# EAGLE schematic SparkFun_RTK_EVK (EAGLE 9.6.2)

## Sheet 1 of 2
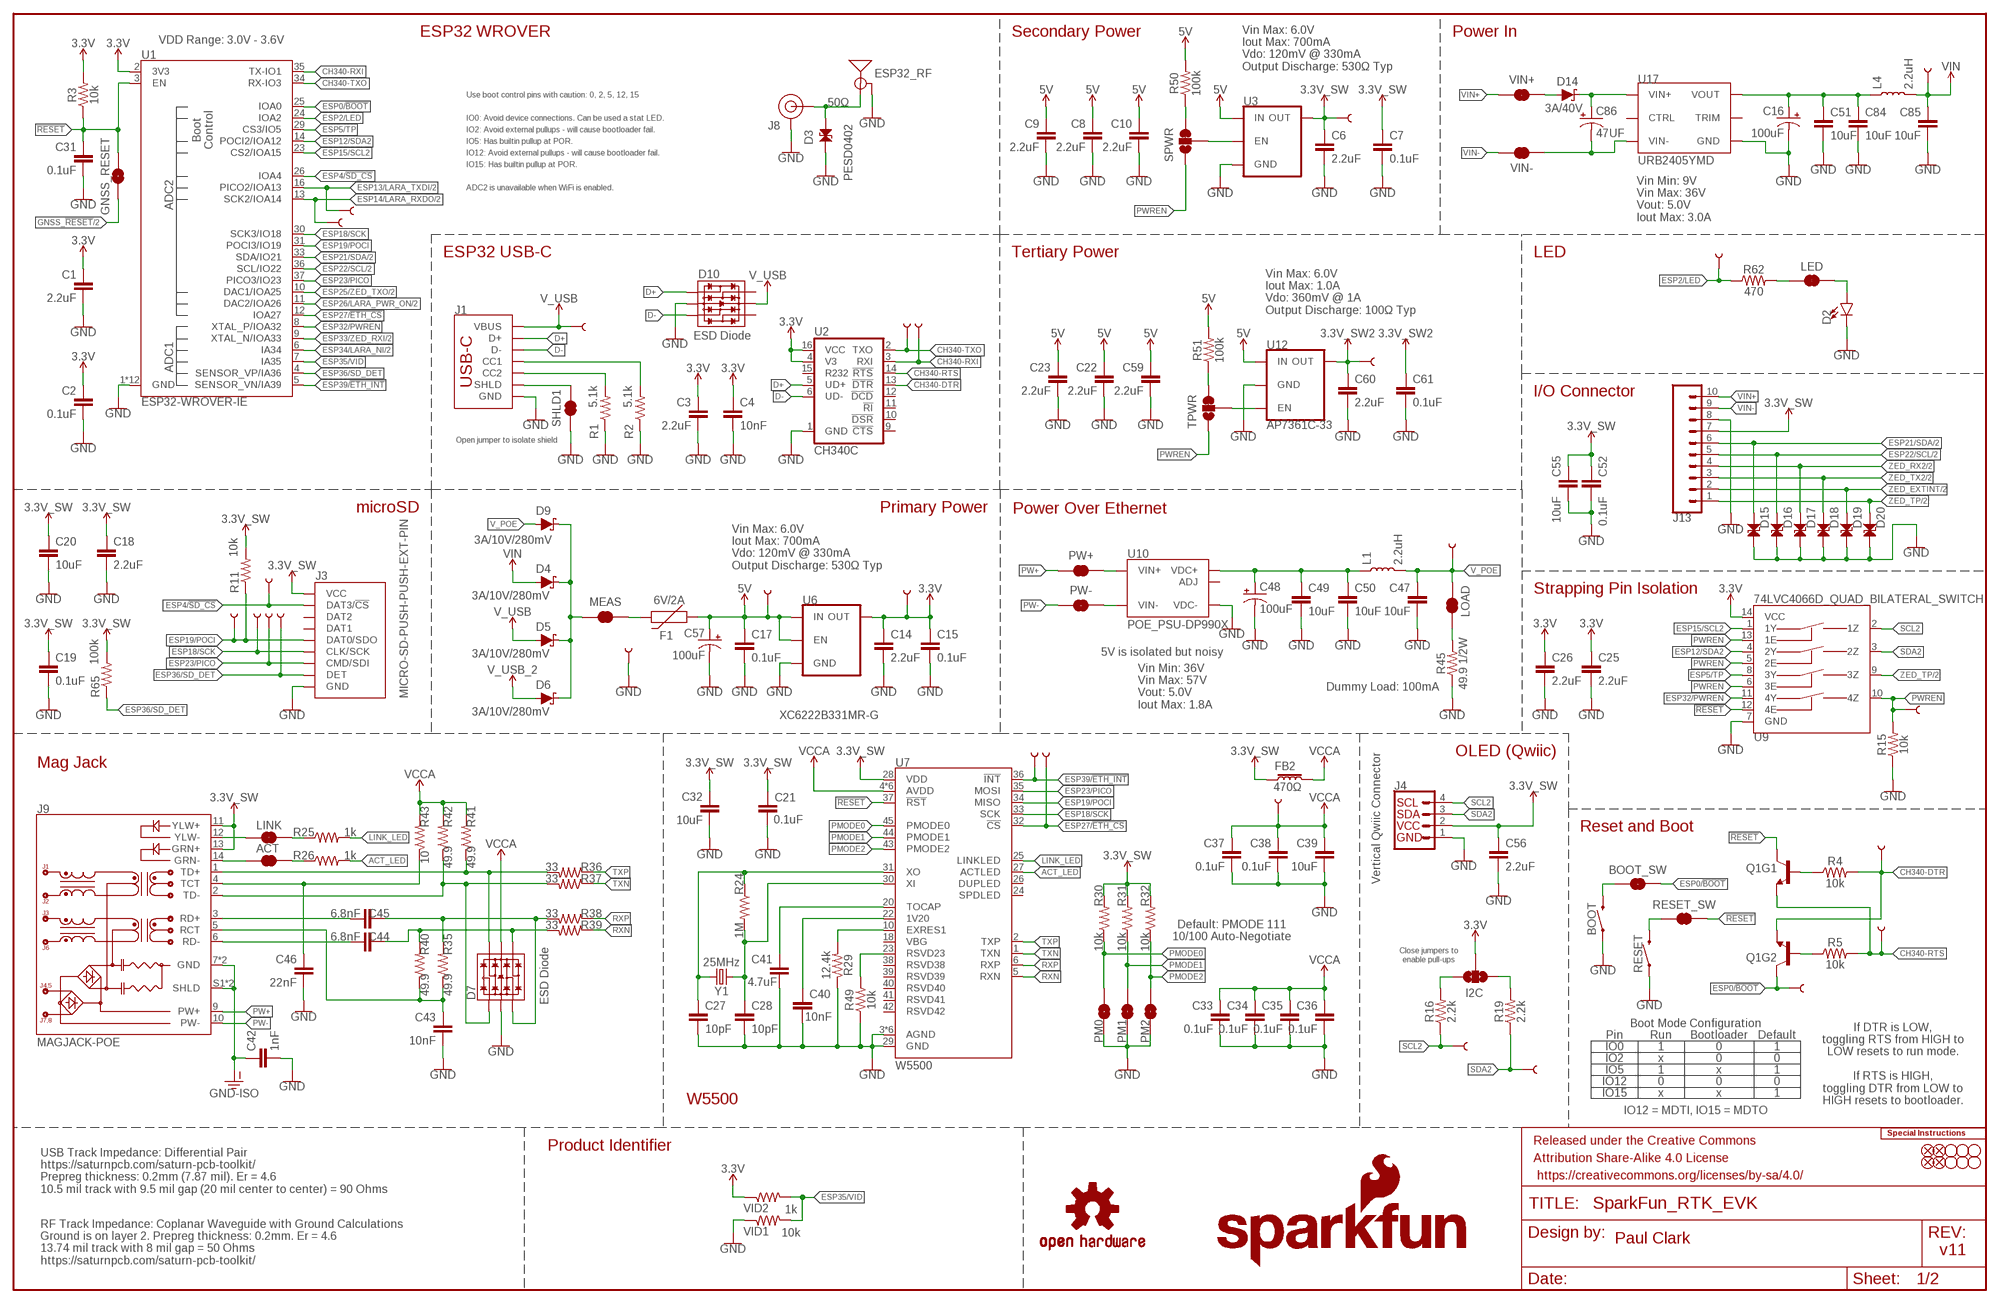
[diagram p0: schematic, sheet 1]

### Parts
3V3  TEST-POINTPOGO_PTH  [1X01_NO_SILK]
3V3_SW  TEST-POINTPOGO_PTH  [1X01_NO_SILK]
3V3_SW2  TEST-POINTPOGO_PTH  [1X01_NO_SILK]
5V  TEST-POINTPOGO_PTH  [1X01_NO_SILK]
ACT  JUMPER-SMT_2_NC_TRACE_SILK  [SMT-JUMPER_2_NC_TRACE_SILK]
BOOT  MOMENTARY-SWITCH-SPST-PTH-RIGHT-ANGLE-8-020  [TACTILE_SWITCH_PTH_RA_8-020]
BOOT_SW  JUMPER-SMT_2_NC_TRACE_SILK  [SMT-JUMPER_2_NC_TRACE_SILK]
C1  2.2uF  2.2UF-0603-10V-20%  [0603]
C2  0.1uF  0.1UF-0603-25V-5%  [0603]
C3  2.2uF  2.2UF-0603-10V-20%  [0603]
C4  10nF  10NF-0603-50V-10%  [0603]
C6  2.2uF  2.2UF-0603-10V-20%  [0603]
C7  0.1uF  0.1UF-0603-25V-5%  [0603]
C8  2.2uF  2.2UF-0603-10V-20%  [0603]
C9  2.2uF  2.2UF-0603-10V-20%  [0603]
C10  2.2uF  2.2UF-0603-10V-20%  [0603]
C14  2.2uF  2.2UF-0603-10V-20%  [0603]
C15  0.1uF  0.1UF-0603-25V-5%  [0603]
C16  100uF  100UF-POLAR-25V-20%(ELEC)  [PANASONIC_D]
C17  0.1uF  0.1UF-0603-25V-5%  [0603]
C18  2.2uF  2.2UF-0603-10V-20%  [0603]
C19  0.1uF  0.1UF-0603-25V-5%  [0603]
C20  10uF  10UF-0603-6.3V-20%  [0603]
C21  0.1uF  0.1UF-0603-25V-5%  [0603]
C22  2.2uF  2.2UF-0603-10V-20%  [0603]
C23  2.2uF  2.2UF-0603-10V-20%  [0603]
C25  2.2uF  2.2UF-0603-10V-20%  [0603]
C26  2.2uF  2.2UF-0603-10V-20%  [0603]
C27  10pF  10PF-0603-50V-5%  [0603]
C28  10pF  10PF-0603-50V-5%  [0603]
C31  0.1uF  0.1UF-0603-25V-5%  [0603]
C32  10uF  10UF-0603-6.3V-20%  [0603]
C33  0.1uF  0.1UF-0603-25V-5%  [0603]
C34  0.1uF  0.1UF-0603-25V-5%  [0603]
C35  0.1uF  0.1UF-0603-25V-5%  [0603]
C36  0.1uF  0.1UF-0603-25V-5%  [0603]
C37  0.1uF  0.1UF-0603-25V-5%  [0603]
C38  0.1uF  0.1UF-0603-25V-5%  [0603]
C39  10uF  10UF-0603-6.3V-20%  [0603]
C40  10nF  10NF-0603-50V-10%  [0603]
C41  4.7uF  4.7UF-0603-6.3V-(10%)  [0603]
C42  1nF  1.0NF/1000PF-1206-2KV-10%  [1206]
C43  10nF  10NF-0603-50V-10%  [0603]
C44  6.8nF  6.8NF/6800PF-0603-50V-5%  [0603]
C45  6.8nF  6.8NF/6800PF-0603-50V-5%  [0603]
C46  22nF  22NF/22,000PF-0603-50V-10%  [0603]
C47  10uF  10UF-0805-25V-10%  [0805]
C48  100uF  100UF-POLAR-25V-20%(ELEC)  [PANASONIC_D]
C49  10uF  10UF-0805-25V-10%  [0805]
C50  10uF  10UF-0805-25V-10%  [0805]
C51  10uF  10UF-0805-25V-10%  [0805]
C52  0.1uF  0.1UF-0603-25V-5%  [0603]
C55  10uF  10UF-0603-6.3V-20%  [0603]
C56  2.2uF  2.2UF-0603-10V-20%  [0603]
C57  100uF  100UF-POLAR-25V-20%(ELEC)  [PANASONIC_D]
C59  2.2uF  2.2UF-0603-10V-20%  [0603]
C60  2.2uF  2.2UF-0603-10V-20%  [0603]
C61  0.1uF  0.1UF-0603-25V-5%  [0603]
C84  10uF  10UF-0805-25V-10%  [0805]
C85  10uF  10UF-0805-25V-10%  [0805]
C86  47UF  47UF-POLAR-PANASONIC_D-50V-20%  [PANASONIC_D]
D2  LED-RIGHT-ANGLE-PTH-GREEN  [CBI-RIGHT-ANGLE-PTH]
D3  PESD0402  PESD0402-0402  [0402]
D4  3A/10V/280mV  DIODE-SCHOTTKY-BAT60A  [SOD-323]
D5  3A/10V/280mV  DIODE-SCHOTTKY-BAT60A  [SOD-323]
D6  3A/10V/280mV  DIODE-SCHOTTKY-BAT60A  [SOD-323]
D7  ESD Diode  TVS_DIODE_ARRAY_DT1042-04SO-7  [SOT-23-6]
D9  3A/10V/280mV  DIODE-SCHOTTKY-BAT60A  [SOD-323]
D10  ESD Diode  TVS_DIODE_ARRAY_DT1042-04SO-7  [SOT-23-6]
D14  3A/40V  DIODE-SCHOTTKY-B340A  [SMA-DIODE]
D15  PESD0402-0402  [0402]
D16  PESD0402-0402  [0402]
D17  PESD0402-0402  [0402]
D18  PESD0402-0402  [0402]
D19  PESD0402-0402  [0402]
D20  PESD0402-0402  [0402]
DET  TEST-POINTPOGO_PTH  [1X01_NO_SILK]
DTR  TEST-POINTPOGO_PTH  [1X01_NO_SILK]
ESP32_RF  ANTENNA-SMA-GROUNDEDEDGE_RPSMA  [RP-SMA-EDGE]
ETH_CS  TEST-POINTPOGO_PTH  [1X01_NO_SILK]
ETH_INT  TEST-POINTPOGO_PTH  [1X01_NO_SILK]
F1  6V/2A  PPTC_6V2A  [1210]
FB2  470Ω  FERRITE_BEAD-0603-470Ω-100MHZ-1A-200MILIΩ  [0603]
FD1  FIDUCIAL1X2  [FIDUCIAL-1X2]
FD2  FIDUCIAL1X2  [FIDUCIAL-1X2]
FD3  FIDUCIAL1X2  [FIDUCIAL-1X2]
FD4  FIDUCIAL1X2  [FIDUCIAL-1X2]
FRAME1  FRAME-LEDGER  [CREATIVE_COMMONS]
GND  TEST-POINTPOGO_PTH  [1X01_NO_SILK]
GNSS_RESET  JUMPER-COMBO_2_NO  [COMBO-JUMPER_2_NO]
H1  STAND-OFFTIGHT  [STAND-OFF-TIGHT]
H2  STAND-OFFTIGHT  [STAND-OFF-TIGHT]
H3  STAND-OFFTIGHT  [STAND-OFF-TIGHT]
H4  STAND-OFFTIGHT  [STAND-OFF-TIGHT]
H5  STAND-OFFTIGHT  [STAND-OFF-TIGHT]
H6  STAND-OFFTIGHT  [STAND-OFF-TIGHT]
I2C  JUMPER-SMT_3_NO_SILK  [SMT-JUMPER_3_NO_SILK]
J1  USB_C_4-LAYER_PADS  [USB-C-16P_4LAYER-PADS]
J3  MICRO-SD-PUSH-PUSH-EXT-PIN  [MICROSD-EXTERNALPIN]
J4  Vertical Qwiic Connector  QWIIC_CONNECTOR  [JST04_1MM_VERT]
J8  U.FL2PIN-REDUCED-FOOTPRINT  [U.FL_REDUCED_FOOTPRINT]
J9  MAGJACK-POE  [MAGJACK-SYM_LED]
J13  CONN_10_3.5MM_RA_HEADER  [1X10_SCREW_TERMINAL_3.5MM]
L1  2.2uH  INDUCTOR-0805_WIDE-2.2UH  [0805-WIDE]
L4  2.2uH  INDUCTOR-0805_WIDE-2.2UH  [0805-WIDE]
LED  JUMPER-SMT_2_NC_TRACE_SILK  [SMT-JUMPER_2_NC_TRACE_SILK]
LINK  JUMPER-SMT_2_NC_TRACE_SILK  [SMT-JUMPER_2_NC_TRACE_SILK]
LOAD  JUMPER-SMT_2_NC_TRACE_SILK  [SMT-JUMPER_2_NC_TRACE_SILK]
LOGO1  SPECIAL_INSTRUCTIONS-ORDERING  [ORDERING_INSTRUCTIONS]
LOGO4  OSHW-LOGOS  [OSHW-LOGO-S]
LOGO5  SFE_LOGO_NAME.2_INCH  [SFE_LOGO_NAME_.2]
LOGO6  SFE_LOGO_FLAME.2_INCH  [SFE_LOGO_FLAME_.2]
MEAS  JUMPER-COMBO_2_NC_TRACE  [COMBO-JUMPER_2_NC_TRACE]
PICO  TEST-POINTPOGO_PTH  [1X01_NO_SILK]
PM0  JUMPER-SMT_2_NO_SILK  [SMT-JUMPER_2_NO_SILK]
PM1  JUMPER-SMT_2_NO_SILK  [SMT-JUMPER_2_NO_SILK]
PM2  JUMPER-SMT_2_NO_SILK  [SMT-JUMPER_2_NO_SILK]
POCI  TEST-POINTPOGO_PTH  [1X01_NO_SILK]
PW+  JUMPER-COMBO_2_NC_TRACE  [COMBO-JUMPER_2_NC_TRACE]
PW-  JUMPER-COMBO_2_NC_TRACE  [COMBO-JUMPER_2_NC_TRACE]
PWREN  TEST-POINTPOGO_PTH  [1X01_NO_SILK]
Q1  TRANS_NPN_DUAL-MBT3904DW1T1  [SC70-6]
R1  5.1k  5.1KOHM5.1KOHM-0603-1/10W-1%  [0603]
R2  5.1k  5.1KOHM5.1KOHM-0603-1/10W-1%  [0603]
R3  10k  10KOHM-0603-1/10W-1%  [0603]
R4  10k  10KOHM-0603-1/10W-1%  [0603]
R5  10k  10KOHM-0603-1/10W-1%  [0603]
R11  10k  10KOHM-0603-1/10W-1%  [0603]
R15  10k  10KOHM-0603-1/10W-1%  [0603]
R16  2.2k  2.2KOHM-0603-1/10W-1%  [0603]
R19  2.2k  2.2KOHM-0603-1/10W-1%  [0603]
R24  1M  1MOHM-0603-1/4W-5%  [0603]
R25  1k  1KOHM-0603-1/10W-1%  [0603]
R26  1k  1KOHM-0603-1/10W-1%  [0603]
R29  12.4k  12.4KOHM-0603-1/10W-1%  [0603]
R30  10k  10KOHM-0603-1/10W-1%  [0603]
R31  10k  10KOHM-0603-1/10W-1%  [0603]
R32  10k  10KOHM-0603-1/10W-1%  [0603]
R35  49.9  49.9OHM-0603-1/10W-1%  [0603]
R36  33  33OHM-0603-1/10W-1%  [0603]
R37  33  33OHM-0603-1/10W-1%  [0603]
R38  33  33OHM-0603-1/10W-1%  [0603]
R39  33  33OHM-0603-1/10W-1%  [0603]
R40  49.9  49.9OHM-0603-1/10W-1%  [0603]
R41  49.9  49.9OHM-0603-1/10W-1%  [0603]
R42  49.9  49.9OHM-0603-1/10W-1%  [0603]
R43  10  10OHM-0603-1/10W-1%  [0603]
R45  49.9 1/2W  49.9OHM-1206-1/2W-1%  [1206]
R49  10k  10KOHM-0603-1/10W-1%  [0603]
R50  100k  100KOHM-0603-1/10W-1%  [0603]
R51  100k  100KOHM-0603-1/10W-1%  [0603]
R62  470  470OHM-0603-1/10W-1%  [0603]
R65  100k  100KOHM-0603-1/10W-1%  [0603]
RESET  MOMENTARY-SWITCH-SPST-PTH-RIGHT-ANGLE-8-020  [TACTILE_SWITCH_PTH_RA_8-020]
RESET_SW  JUMPER-SMT_2_NC_TRACE_SILK  [SMT-JUMPER_2_NC_TRACE_SILK]
RTS  TEST-POINTPOGO_PTH  [1X01_NO_SILK]
RX  TEST-POINTPOGO_PTH  [1X01_NO_SILK]
RXD  TEST-POINTPOGO_PTH  [1X01_NO_SILK]
SCK  TEST-POINTPOGO_PTH  [1X01_NO_SILK]
SCL2  TEST-POINTPOGO_PTH  [1X01_NO_SILK]
SD_CS  TEST-POINTPOGO_PTH  [1X01_NO_SILK]
SDA2  TEST-POINTPOGO_PTH  [1X01_NO_SILK]
SHLD1  JUMPER-SMT_2_NC_TRACE_SILK  [SMT-JUMPER_2_NC_TRACE_SILK]
SPWR  JUMPER-SMT_3_1-NC_TRACE_SILK  [SMT-JUMPER_3_1-NC_TRACE_SILK]
TP_BOOT  TEST-POINTPOGO_PTH  [1X01_NO_SILK]
TP_LED  TEST-POINTPOGO_PTH  [1X01_NO_SILK]
TPWR  JUMPER-SMT_3_1-NC_TRACE_SILK  [SMT-JUMPER_3_1-NC_TRACE_SILK]
TX  TEST-POINTPOGO_PTH  [1X01_NO_SILK]
TXD  TEST-POINTPOGO_PTH  [1X01_NO_SILK]
U1  ESP32-WROVER-IE  ESP32-WROVER-E/IE_IE-N16R8  [ESP32-WROVER-E/IE]
U2  CH340C  [SO016]
U3  XC6222B331MR-G  [SOT23-5]
U6  XC6222B331MR-G  [SOT23-5]
U7  W5500  [LQFP-48]
U9  74LVC4066D_QUAD_BILATERAL_SWITCH  [SO14]
U10  POE_PSU-DP990X  [DP990X]
U12  AP7361C-33  AP7361C-33FGEUDFN-8  [UDFN-8]
U17  URB2405YMD  URB_YMD-15WR3__URB2405YMD-15WR3  [URB_YMD-15WR3]
VCCA  TEST-POINTPOGO_PTH  [1X01_NO_SILK]
VID1  10k  10KOHM-0603-1/10W-1%  [0603]
VID2  1k  1KOHM-0603-1/10W-1%  [0603]
VIN  TEST-POINTPOGO_PTH  [1X01_NO_SILK]
VIN+  JUMPER-COMBO_2_NC_TRACE  [COMBO-JUMPER_2_NC_TRACE]
VIN-  JUMPER-COMBO_2_NC_TRACE  [COMBO-JUMPER_2_NC_TRACE]
VPOE  TEST-POINTPOGO_PTH  [1X01_NO_SILK]
VUSB  TEST-POINTPOGO_PTH  [1X01_NO_SILK]
Y1  25MHz  CRYSTAL-25MHZ-SMD-2.0X1.6MM  [CRYSTAL-SMD-2.0X1.6MM]

### Nets
3.3V: 3V3.1 C1.1 C2.1 C3.1 C4.1 C14.1 C15.1 C25.1 C26.1 I2C.2 R3.2 U1.2(3V3) U2.4(V3) U2.16(VCC) U6.5(OUT) U9.14(VCC) VID2.1
3.3V_SW: 3V3_SW.1 C6.1 C7.1 C18.1 C19.1 C20.1 C21.1 C32.1 C52.1 C55.1 C56.1 FB2.1 J3.4(VCC) J4.2 J9.11(YLW+) J9.13(GRN+) J13.7 R11.2 R30.2 R31.2 R32.2 R65.2 U3.5(OUT) U7.28(VDD) ; also sheet 2
3.3V_SW2: 3V3_SW2.1 C60.1 C61.1 U12.1(OUT) ; also sheet 2
5V: 5V.1 C8.1 C9.1 C10.1 C17.1 C22.1 C23.1 C57.+ C59.1 F1.1 R50.2 R51.2 U3.1(IN) U6.1(IN) U6.3(EN) U12.8(IN) ; also sheet 2
5V_RAW: C48.+ C49.1 C50.1 L1.1 U10.1(VDC+) U10.2(VDC+)
5V_RAW1: C16.+ C51.1 C84.1 L4.1 U17.4(VOUT)
!RESET!: C31.1 GNSS_RESET.2 GNSS_RESET.4 Q1.3(C) R3.1 RESET_SW.1 U1.3(EN) U7.37(!RST!) U9.12(4E)
ACT: ACT.1 J9.14(GRN-)
ACT_LED: R26.2 U7.27(ACTLED)
CH340-DTR: DTR.1 Q1.1(E) R4.2 U2.13(!DTR)
CH340-RTS: Q1.4(E) R5.2 RTS.1 U2.14(!RTS)
CH340-RXI: TX.1 U1.35(TX-IO1) U2.3(RXI)
CH340-TXO: RX.1 U1.34(RX-IO3) U2.2(TXO)
D+: D10.1(IO1) J1.A6(D+) J1.B6(D+) U2.5(UD+)
D-: D10.3(IO2) J1.A7(D-) J1.B7(D-) U2.6(UD-)
ESP0/!BOOT!: BOOT_SW.1 Q1.6(C) TP_BOOT.1 U1.25(IOA0)
ESP2/LED: R62.1 TP_LED.1 U1.24(IOA2)
ESP4/!SD_CS!: J3.2(DAT3/!CS!) SD_CS.1 U1.26(IOA4)
ESP5/TP: U1.29(CS3/IO5) U9.8(3Y)
ESP12/SDA2: U1.14(POCI2/IOA12) U9.4(2Y)
ESP13/LARA_TXDI: TXD.1 U1.16(PICO2/IOA13) ; also sheet 2
ESP14/LARA_RXDO: RXD.1 U1.13(SCK2/IOA14) ; also sheet 2
ESP15/SCL2: U1.23(CS2/IOA15) U9.1(1Y)
ESP18/SCK: J3.5(CLK/SCK) SCK.1 U1.30(SCK3/IO18) U7.33(SCK)
ESP19/POCI: J3.7(DAT0/SDO) POCI.1 R11.1 U1.31(POCI3/IO19) U7.34(MISO)
ESP21/SDA: D15.1 J13.6 U1.33(SDA/IO21) ; also sheet 2
ESP22/SCL: D16.1 J13.5 U1.36(SCL/IO22) ; also sheet 2
ESP23/PICO: J3.3(CMD/SDI) PICO.1 U1.37(PICO3/IO23) U7.35(MOSI)
ESP25/ZED_TXO: U1.10(DAC1/IOA25) ; also sheet 2
ESP26/LARA_PWR_ON: U1.11(DAC2/IOA26) ; also sheet 2
ESP27/!ETH_CS!: ETH_CS.1 U1.12(IOA27) U7.32(!CS!)
ESP32/PWREN: U1.8(XTAL_P/IOA32) U9.11(4Y)
ESP33/ZED_RXI: U1.9(XTAL_N/IOA33) ; also sheet 2
ESP34/LARA_NI: U1.6(IA34) ; also sheet 2
ESP35/VID: U1.7(IA35) VID1.2 VID2.2
ESP36/SD_DET: DET.1 J3.9(DET) R65.1 U1.4(SENSOR_VP/IA36)
ESP39/!ETH_INT!: ETH_INT.1 U1.5(SENSOR_VN/IA39) U7.36(!INT!)
GND: BOOT.1 C1.2 C2.2 C3.2 C4.2 C6.2 C7.2 C8.2 C9.2 C10.2 C14.2 C15.2 C16.- C17.2 C18.2 C19.2 C20.2 C21.2 C22.2 C23.2 C25.2 C26.2 C27.2 C28.2 C31.2 C32.2 C33.2 C34.2 C35.2 C36.2 C37.2 C38.2 C39.2 C40.2 C41.2 C42.2 C43.2 C46.2 C47.2 C48.- C49.2 C50.2 C51.2 C52.2 C55.2 C56.2 C57.- C59.2 C60.2 C61.2 C84.2 C85.2 D2.C D3.2 D7.2(VSS) D10.2(VSS) D15.2 D16.2 D17.2 D18.2 D19.2 D20.2 ESP32_RF.GND@0(GND) ESP32_RF.GND@1(GND) ESP32_RF.GND@2(GND) ESP32_RF.GND@3(GND) GND.1 J1.GND J1.GND2(GND) J3.6(GND) J3.10(GND) J3.11(GND) J3.12(GND) J3.13(GND) J4.1 J8.1(GND) J8.2(GND) J13.8 PM0.1 PM1.1 PM2.1 R1.1 R2.1 R15.1 R29.1 R45.1 R49.1 RESET.1 SHLD1.1 U1.1(GND) U1.15(GND) U1.38(GND) U1.GND U1.GNDT1(GND) U1.GNDT2(GND) U1.GNDT3(GND) U1.GNDT4(GND) U1.GNDT5(GND) U1.GNDT6(GND) U1.GNDT7(GND) U1.GNDT8(GND) U2.1(GND) U3.2(GND) U6.2(GND) U7.3(AGND) U7.9(AGND) U7.14(AGND) U7.16(AGND) U7.19(AGND) U7.29(GND) U7.48(AGND) U9.7(GND) U10.3(VDC-) U12.4(GND) U12.EP(GND) U17.6(GND) VID1.1 ; also sheet 2
GND-ISO: C42.1 J9.7(GND) J9.8(GND) J9.S1(SHLD) J9.S2(SHLD)
GNSS_!RESET!: GNSS_RESET.1 GNSS_RESET.3 ; also sheet 2
LINK: J9.12(YLW-) LINK.1
LINK_LED: R25.2 U7.25(LINKLED)
MEAS: D4.C D5.C D6.C D9.C MEAS.2 MEAS.4
N$1: J1.B5(CC2) R1.2
N$2: J1.A5(CC1) R2.2
N$4: Q1.2(B) R5.1
N$5: Q1.5(B) R4.1
N$7: LED.2 R62.2
N$10: F1.2 MEAS.1 MEAS.3
N$12: ACT.2 R26.1
N$13: D3.1 ESP32_RF.SIG(SIGNAL) J8.FEED(SIGNAL)
N$14: I2C.3 R16.2
N$15: I2C.1 R19.2
N$19: C27.1 R24.1 U7.31(XO) Y1.1
N$20: C28.1 R24.2 U7.30(XI) Y1.3
N$21: LINK.2 R25.1
N$22: R50.1 SPWR.3
N$23: R29.2 U7.10(EXRES1)
N$24: C40.1 U7.22(1V20)
N$25: C41.1 U7.20(TOCAP)
N$26: SPWR.2 U3.3(EN)
N$27: LOAD.1 R45.2
N$28: RESET.2 RESET_SW.2
N$29: BOOT.2 BOOT_SW.2
N$30: R49.2 U7.23(RSVD23)
N$31: R51.1 TPWR.3
N$39: TPWR.2 U12.5(EN)
N$45: D2.A LED.1
PMODE0: PM0.2 R30.1 U7.45(PMODE0)
PMODE1: PM1.2 R31.1 U7.44(PMODE1)
PMODE2: PM2.2 R32.1 U7.43(PMODE2)
PW1+: PW+.1 PW+.3 U10.5(VIN+) U10.6(VIN+)
PW1-: PW-.1 PW-.3 U10.7(VIN-) U10.8(VIN-)
PW+: J9.9(PW+) PW+.2 PW+.4
PW-: J9.10(PW-) PW-.2 PW-.4
PWREN: PWREN.1 R15.2 SPWR.1 TPWR.1 U9.5(2E) U9.6(3E) U9.10(4Z) U9.13(1E)
RCT: C43.1 J9.5(RCT) R35.1 R40.1
RD+: C45.2 J9.3(RD+)
RD-: C44.2 J9.6(RD-)
RXN: R39.1 U7.5(RXN)
RXN1: C44.1 D7.4(IO3) R39.2 R40.2
RXP: R38.1 U7.6(RXP)
RXP1: C45.1 D7.3(IO2) R35.2 R38.2
SCL2: J4.4 R16.1 SCL2.1 U9.2(1Z)
SDA2: J4.3 R19.1 SDA2.1 U9.3(2Z)
SHIELD: J1.SHLD1(SHLD) J1.SHLD2(SHLD) J1.SHLD3(SHLD) J1.SHLD4(SHLD) SHLD1.2
TCT: C46.1 J9.4(TCT) R43.1
TD+: D7.6(IO4) J9.1(TD+) R36.2 R41.1
TD-: D7.1(IO1) J9.2(TD-) R37.2 R42.1
TXN: R37.1 U7.1(TXN)
TXP: R36.1 U7.2(TXP)
V_POE: C47.1 D9.A L1.2 LOAD.2 VPOE.1
V_USB: D5.A D10.5(VCC) J1.VBUS1(VBUS) J1.VBUS2(VBUS) VUSB.1
V_USB_2: D6.A ; also sheet 2
VCCA: C33.1 C34.1 C35.1 C36.1 C37.1 C38.1 C39.1 D7.5(VCC) FB2.2 R41.2 R42.2 R43.2 U7.4(AVDD) U7.8(AVDD) U7.11(AVDD) U7.15(AVDD) U7.17(AVDD) U7.21(AVDD) VCCA.1
VIN: C85.1 D4.A L4.2 VIN.1
VIN1+: D14.A VIN+.1 VIN+.3
VIN1-: C86.- U17.2(VIN-) VIN-.2 VIN-.4
VIN2+: C86.+ D14.C U17.3(VIN+)
VIN+: J13.10 VIN+.2 VIN+.4
VIN-: J13.9 VIN-.1 VIN-.3
ZED_EXTINT: D19.1 J13.2 ; also sheet 2
ZED_RX2: D17.1 J13.4 ; also sheet 2
ZED_TP: D20.1 J13.1 U9.9(3Z) ; also sheet 2
ZED_TX2: D18.1 J13.3 ; also sheet 2
Unconnected: D10.4(IO3) D10.6(IO4) J3.1(DAT2) J3.8(DAT1) U2.9(!CTS) U2.10(!DSR) U2.11(!RI) U2.12(!DCD) U2.15(R232) U7.18(VBG) U7.24(SPDLED) U7.26(DUPLED) U7.38(RSVD38) U7.39(RSVD39) U7.40(RSVD40) U7.41(RSVD41) U7.42(RSVD42) U10.4(ADJ) U17.1(CTRL) U17.5(TRIM)

### Notes on the sheet
- Secondary Power | Power In
- VDD Range: 3.0V - 3.6V | ESP32 WROVER
- Vin Max: 6.0V
  Iout Max: 700mA
  Vdo: 120mV @ 330mA
  Output Discharge: 530Ω Typ
- Use boot control pins with caution: 0, 2, 5, 12, 15
- 50Ω
- IO0: Avoid device connections. Can be used a stat LED.
- IO2: Avoid external pullups - will cause bootloader fail.
- IO5: Has builtin pullup at POR.
- IO12: Avoid external pullups - will cause bootloader fail.
- IO15: Has builtin pullup at POR.
- ADC2 is unavailable when WiFi is enabled.
- Vin Min: 9V
  Vin Max: 36V
  Vout: 5.0V
  Iout Max: 3.0A
- ESP32 USB-C | Tertiary Power | LED
- Vin Max: 6.0V
  Iout Max: 1.0A
  Vdo: 360mV @ 1A
  Output Discharge: 100Ω Typ
- I/O Connector
- Open jumper to isolate shield
- microSD | Primary Power | Power Over Ethernet
- Vin Max: 6.0V
  Iout Max: 700mA
  Vdo: 120mV @ 330mA
  Output Discharge: 530Ω Typ
- Strapping Pin Isolation
- 5V is isolated but noisy
- Dummy Load: 100mA
- Vin Min: 36V
  Vin Max: 57V
  Vout: 5.0V
  Iout Max: 1.8A
- OLED (Qwiic)
- Mag Jack
- Reset and Boot
- Default: PMODE 111
  10/100 Auto-Negotiate
- Close jumpers to
  enable pull-ups
- Boot Mode Configuration
- If DTR is LOW,
  toggling RTS from HIGH to
  LOW resets to run mode.
  
  If RTS is HIGH,
  toggling DTR from LOW to
  HIGH resets to bootloader.
- Pin | Run | Bootloader | Default
- IO0 | 1 | 0 | 1
- IO2 | x | 0 | 0
- IO5 | 1 | x | 1
- IO12 | 0 | 0 | 0
- IO15 | x | x | 1
- W5500
- IO12 = MDTI, IO15 = MDTO
- Product Identifier
- USB Track Impedance: Differential Pair
  https://saturnpcb.com/saturn-pcb-toolkit/
  Prepreg thickness: 0.2mm (7.87 mil). Er = 4.6
  10.5 mil track with 9.5 mil gap (20 mil center to center) = 90 Ohms
- Paul Clark
- v11
- RF Track Impedance: Coplanar Waveguide with Ground Calculations
  Ground is on layer 2. Prepreg thickness: 0.2mm. Er = 4.6
  13.74 mil track with 8 mil gap = 50 Ohms
  https://saturnpcb.com/saturn-pcb-toolkit/

## Sheet 2 of 2
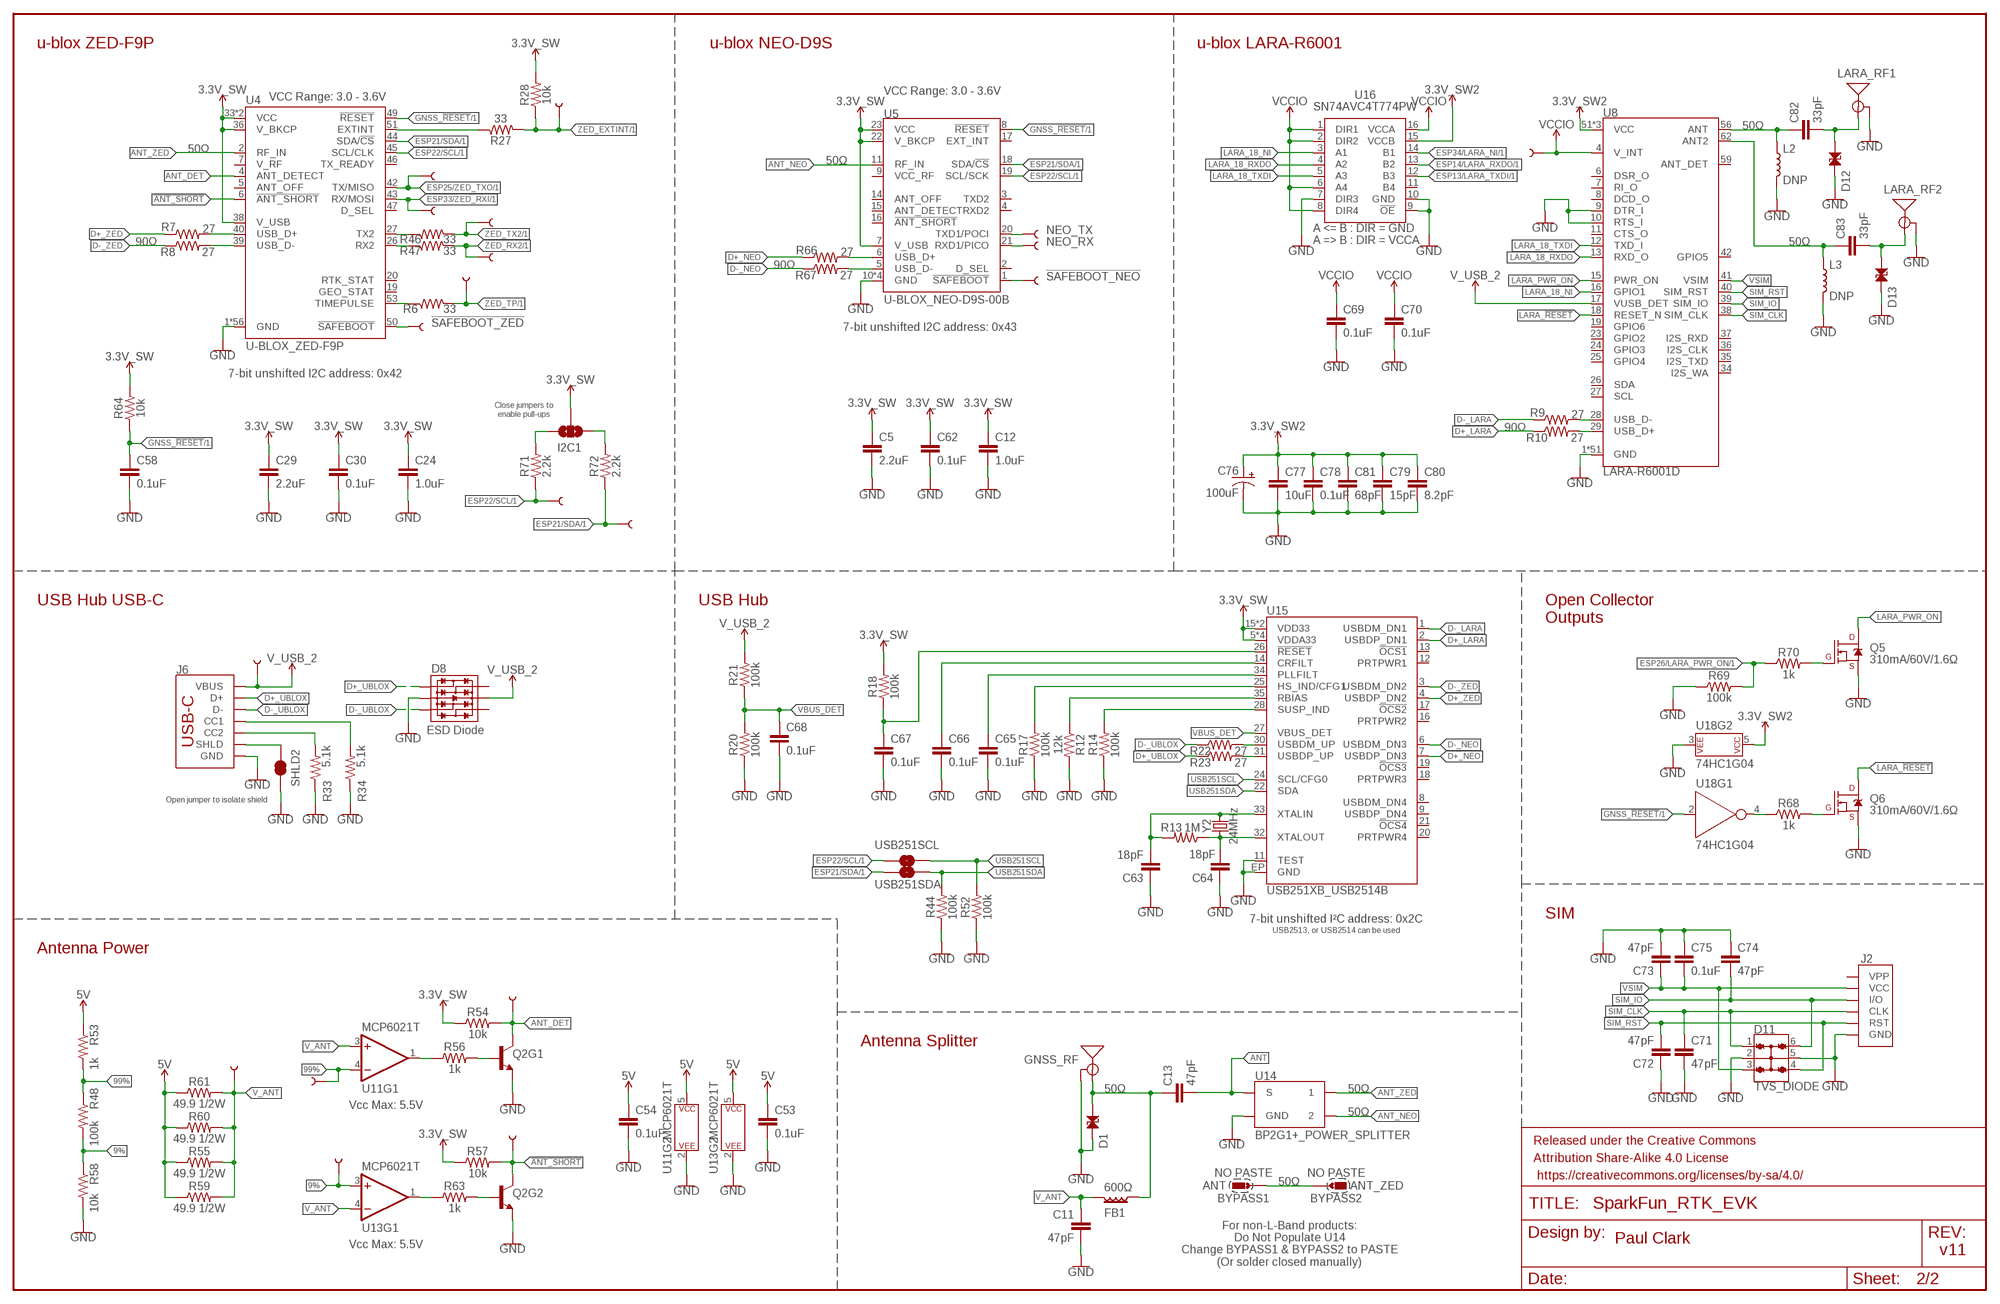
[diagram p1: schematic, sheet 2]

### Parts
9%  TEST-POINTPOGO_PTH  [1X01_NO_SILK]
99%  TEST-POINTPOGO_PTH  [1X01_NO_SILK]
!SAFEBOOT_NEO!  TEST-POINTPOGO_PTH  [1X01_NO_SILK]
!SAFEBOOT_ZED!  TEST-POINTPOGO_PTH  [1X01_NO_SILK]
ANT_DET  TEST-POINTPOGO_PTH  [1X01_NO_SILK]
ANT_SHT  TEST-POINTPOGO_PTH  [1X01_NO_SILK]
BYPASS1  NO PASTE  JUMPER-SMT_2_SOIC-PAD_NO-PASTE  [SMT-JUMPER_2_SOIC-PAD_NO-PASTE]
BYPASS2  NO PASTE  JUMPER-SMT_2_SOIC-PAD_NO-PASTE  [SMT-JUMPER_2_SOIC-PAD_NO-PASTE]
C5  2.2uF  2.2UF-0603-10V-20%  [0603]
C11  47pF  47PF-0603-50V-5%  [0603]
C12  1.0uF  1.0UF-0603-16V-10%  [0603]
C13  47pF  47PF-0603-50V-5%  [0603]
C24  1.0uF  1.0UF-0603-16V-10%  [0603]
C29  2.2uF  2.2UF-0603-10V-20%  [0603]
C30  0.1uF  0.1UF-0603-25V-5%  [0603]
C53  0.1uF  0.1UF-0603-25V-5%  [0603]
C54  0.1uF  0.1UF-0603-25V-5%  [0603]
C58  0.1uF  0.1UF-0603-25V-5%  [0603]
C62  0.1uF  0.1UF-0603-25V-5%  [0603]
C63  18pF  18PF-0603-50V-5%  [0603]
C64  18pF  18PF-0603-50V-5%  [0603]
C65  0.1uF  0.1UF-0603-25V-5%  [0603]
C66  0.1uF  0.1UF-0603-25V-5%  [0603]
C67  0.1uF  0.1UF-0603-25V-5%  [0603]
C68  0.1uF  0.1UF-0603-25V-5%  [0603]
C69  0.1uF  0.1UF-0603-25V-5%  [0603]
C70  0.1uF  0.1UF-0603-25V-5%  [0603]
C71  47pF  47PF-0603-50V-5%  [0603]
C72  47pF  47PF-0603-50V-5%  [0603]
C73  47pF  47PF-0603-50V-5%  [0603]
C74  47pF  47PF-0603-50V-5%  [0603]
C75  0.1uF  0.1UF-0603-25V-5%  [0603]
C76  100uF  100UF-POLAR-25V-20%(ELEC)  [PANASONIC_D]
C77  10uF  10UF-0805-25V-10%  [0805]
C78  0.1uF  0.1UF-0603-25V-5%  [0603]
C79  15pF  15PF-0603-50V-5%  [0603]
C80  8.2pF  8.2PF-0603-50V-10%  [0603]
C81  68pF  68PF-0603-50V-5%  [0603]
C82  33pF  33PF-0603-50V-5%  [0603]
C83  33pF  33PF-0603-50V-5%  [0603]
D1  PESD0402-0402  [0402]
D8  ESD Diode  TVS_DIODE_ARRAY_DT1042-04SO-7  [SOT-23-6]
D11  TVS_DIODE  TVS_DIODE_ARRAY_4_ESDA6V1BC6  [SOT23-6L]
D12  PESD0402-0402  [0402]
D13  PESD0402-0402  [0402]
FB1  600Ω  FERRITE_BEAD-0805-600Ω-100MHZ  [0805]
FRAME2  FRAME-LEDGERNO_FOOTPRINT  [DUMMY]
GNSS_RF  ANTENNA-SMA-GROUNDEDEDGE_SMA  [SMA-EDGE]
I2C1  JUMPER-SMT_3_NO_SILK  [SMT-JUMPER_3_NO_SILK]
J2  SIMHOLDER-PUSHPUSH  [NANO_SIM_PP]
J6  USB_C_4-LAYER_PADS  [USB-C-16P_4LAYER-PADS]
L2  DNP  DNP-0603_NO-CREAM  [0603_NO-CREAM]
L3  DNP  DNP-0603_NO-CREAM  [0603_NO-CREAM]
LARA_RF1  ANTENNA-SMA-GROUNDEDEDGE_SMA  [SMA-EDGE]
LARA_RF2  ANTENNA-SMA-GROUNDEDEDGE_SMA  [SMA-EDGE]
NEO_RX  TEST-POINTPOGO_PTH  [1X01_NO_SILK]
NEO_TX  TEST-POINTPOGO_PTH  [1X01_NO_SILK]
Q2  TRANS_NPN_DUAL-MBT3904DW1T1  [SC70-6]
Q5  310mA/60V/1.6Ω  MOSFET-NCH-2N7002PW  [SOT323]
Q6  310mA/60V/1.6Ω  MOSFET-NCH-2N7002PW  [SOT323]
R6  33  33OHM-0603-1/10W-1%  [0603]
R7  27  27OHM-0603-1/10W-1%  [0603]
R8  27  27OHM-0603-1/10W-1%  [0603]
R9  27  27OHM-0603-1/10W-1%  [0603]
R10  27  27OHM-0603-1/10W-1%  [0603]
R12  12k  12KOHM-0603-1/10W-1%  [0603]
R13  1M  1MOHM-0603-1/4W-5%  [0603]
R14  100k  100KOHM-0603-1/10W-1%  [0603]
R17  100k  100KOHM-0603-1/10W-1%  [0603]
R18  100k  100KOHM-0603-1/10W-1%  [0603]
R20  100k  100KOHM-0603-1/10W-1%  [0603]
R21  100k  100KOHM-0603-1/10W-1%  [0603]
R22  27  27OHM-0603-1/10W-1%  [0603]
R23  27  27OHM-0603-1/10W-1%  [0603]
R27  33  33OHM-0603-1/10W-1%  [0603]
R28  10k  10KOHM-0603-1/10W-1%  [0603]
R33  5.1k  5.1KOHM5.1KOHM-0603-1/10W-1%  [0603]
R34  5.1k  5.1KOHM5.1KOHM-0603-1/10W-1%  [0603]
R44  100k  100KOHM-0603-1/10W-1%  [0603]
R46  33  33OHM-0603-1/10W-1%  [0603]
R47  33  33OHM-0603-1/10W-1%  [0603]
R48  100k  100KOHM-0603-1/10W-1%  [0603]
R52  100k  100KOHM-0603-1/10W-1%  [0603]
R53  1k  1KOHM-0603-1/10W-1%  [0603]
R54  10k  10KOHM-0603-1/10W-1%  [0603]
R55  49.9 1/2W  49.9OHM-1206-1/2W-1%  [1206]
R56  1k  1KOHM-0603-1/10W-1%  [0603]
R57  10k  10KOHM-0603-1/10W-1%  [0603]
R58  10k  10KOHM-0603-1/10W-1%  [0603]
R59  49.9 1/2W  49.9OHM-1206-1/2W-1%  [1206]
R60  49.9 1/2W  49.9OHM-1206-1/2W-1%  [1206]
R61  49.9 1/2W  49.9OHM-1206-1/2W-1%  [1206]
R63  1k  1KOHM-0603-1/10W-1%  [0603]
R64  10k  10KOHM-0603-1/10W-1%  [0603]
R66  27  27OHM-0603-1/10W-1%  [0603]
R67  27  27OHM-0603-1/10W-1%  [0603]
R68  1k  1KOHM-0603-1/10W-1%  [0603]
R69  100k  100KOHM-0603-1/10W-1%  [0603]
R70  1k  1KOHM-0603-1/10W-1%  [0603]
R71  2.2k  2.2KOHM-0603-1/10W-1%  [0603]
R72  2.2k  2.2KOHM-0603-1/10W-1%  [0603]
RX2  TEST-POINTPOGO_PTH  [1X01_NO_SILK]
SCL  TEST-POINTPOGO_PTH  [1X01_NO_SILK]
SDA  TEST-POINTPOGO_PTH  [1X01_NO_SILK]
SHLD2  JUMPER-SMT_2_NC_TRACE_SILK  [SMT-JUMPER_2_NC_TRACE_SILK]
TP  TEST-POINTPOGO_PTH  [1X01_NO_SILK]
TX2  TEST-POINTPOGO_PTH  [1X01_NO_SILK]
U4  U-BLOX_ZED-F9P  [ZED-F9P]
U5  U-BLOX_NEO-D9S-00B  [NEO-M9N/M8T/M8U/D9S]
U8  LARA-R6001D  LARA-R6_R6001D_GLOBAL_DATA-ONLY  [LARA-LGA]
U11  MCP6021T  MCP6021T-E/OT  [SOT23-5]
U13  MCP6021T  MCP6021T-E/OT  [SOT23-5]
U14  BP2G1+_POWER_SPLITTER  [XX21]
U15  USB251XB_USB2514B  [QFN-36]
U16  SN74AVC4T774PW  [SOP65P640X120-16N]
U18  74HC1G04  [SOT353]
USB251SCL  JUMPER-SMT_2_NO_SILK  [SMT-JUMPER_2_NO_SILK]
USB251SDA  JUMPER-SMT_2_NO_SILK  [SMT-JUMPER_2_NO_SILK]
VANT  TEST-POINTPOGO_PTH  [1X01_NO_SILK]
VCCIO  TEST-POINTPOGO_PTH  [1X01_NO_SILK]
VUSB2  TEST-POINTPOGO_PTH  [1X01_NO_SILK]
Y2  24MHz  CRYSTAL-24MHZ-SMD-2.0X1.6MM  [CRYSTAL-SMD-2.0X1.6MM]
ZED_EXTINT  TEST-POINTPOGO_PTH  [1X01_NO_SILK]
ZED_RXI  TEST-POINTPOGO_PTH  [1X01_NO_SILK]
ZED_TXO  TEST-POINTPOGO_PTH  [1X01_NO_SILK]

### Nets
3.3V_SW: C5.1 C12.1 C24.1 C29.1 C30.1 C62.1 I2C1.2 R18.2 R28.2 R54.1 R57.1 R64.2 U4.33(VCC) U4.34(VCC) U4.36(V_BKCP) U4.38(V_USB) U5.7(V_USB) U5.22(V_BKCP) U5.23(VCC) U15.5(VDDA33) U15.10(VDDA33) U15.15(VDD33) U15.23(VDD33) U15.29(VDDA33) U15.36(VDDA33) ; also sheet 1
3.3V_SW2: C76.+ C77.1 C78.1 C79.1 C80.1 C81.1 U8.51(VCC) U8.52(VCC) U8.53(VCC) U16.15(VCCB) U18.5(P$V+) ; also sheet 1
5V: C53.1 C54.1 R53.1 R55.1 R59.1 R60.1 R61.1 U11.5(P$V+) U13.5(P$V+) ; also sheet 1
9%: 9%.1 R48.2 R58.1 U13.3(+IN)
99%: 99%.1 R48.1 R53.2 U11.4(-IN)
!ANT_SHORT!: ANT_SHT.1 Q2.6(C) R57.2 U4.6(!ANT_SHORT!)
!SAFEBOOT_NEO!: !SAFEBOOT_NEO!.1 U5.1(!SAFEBOOT!)
!SAFEBOOT_ZED!: !SAFEBOOT_ZED!.1 U4.50(!SAFEBOOT!)
ANT: C13.2 U14.2(S)
ANT_DET: ANT_DET.1 Q2.3(C) R54.2 U4.4(ANT_DETECT)
ANT_NEO: U5.11(RF_IN) U14.5
ANT_ZED: U4.2(RF_IN) U14.8
BYPASS: BYPASS1.1 BYPASS2.1
D+_LARA: R10.1 U15.2(USBDP_DN1)
D+_NEO: R66.1 U15.7(USBDP_DN3)
D+_UBLOX: D8.1(IO1) J6.A6(D+) J6.B6(D+) R23.1
D+_ZED: R7.1 U15.4(USBDP_DN2)
D-_LARA: R9.1 U15.1(USBDM_DN1)
D-_NEO: R67.1 U15.6(USBDM_DN3)
D-_UBLOX: D8.3(IO2) J6.A7(D-) J6.B7(D-) R22.1
D-_ZED: R8.1 U15.3(USBDM_DN2)
ESP13/LARA_TXDI: U16.12(B3) ; also sheet 1
ESP14/LARA_RXDO: U16.13(B2) ; also sheet 1
ESP21/SDA: R72.1 SDA.1 U4.44(SDA/!CS!) U5.18(SDA/!CS!) USB251SDA.1 ; also sheet 1
ESP22/SCL: R71.1 SCL.1 U4.45(SCL/CLK) U5.19(SCL/SCK) USB251SCL.1 ; also sheet 1
ESP25/ZED_TXO: U4.42(TX/MISO) ZED_TXO.1 ; also sheet 1
ESP26/LARA_PWR_ON: R69.2 R70.1 ; also sheet 1
ESP33/ZED_RXI: U4.43(RX/MOSI) ZED_RXI.1 ; also sheet 1
ESP34/LARA_NI: U16.14(B1) ; also sheet 1
GND: C5.2 C11.2 C12.2 C24.2 C29.2 C30.2 C53.2 C54.2 C58.2 C62.2 C63.1 C64.1 C65.2 C66.2 C67.2 C68.2 C69.2 C70.2 C71.2 C72.1 C73.2 C74.1 C75.1 C76.- C77.2 C78.2 C79.2 C80.2 C81.2 D1.2 D8.2(VSS) D11.2 D11.5 D12.2 D13.2 GNSS_RF.GND@0(GND) GNSS_RF.GND@1(GND) GNSS_RF.GND@2(GND) GNSS_RF.GND@3(GND) J2.C5(GND) J6.GND J6.GND2(GND) L2.2 L3.2 LARA_RF1.GND@0(GND) LARA_RF1.GND@1(GND) LARA_RF1.GND@2(GND) LARA_RF1.GND@3(GND) LARA_RF2.GND@0(GND) LARA_RF2.GND@1(GND) LARA_RF2.GND@2(GND) LARA_RF2.GND@3(GND) Q2.1(E) Q2.4(E) Q5.2(S) Q6.2(S) R12.2 R14.1 R17.1 R20.1 R33.1 R34.1 R44.1 R52.1 R58.2 R69.1 SHLD2.1 U4.1(GND) U4.3(GND) U4.12(GND) U4.14(GND) U4.32(GND) U4.37(GND) U4.41(GND) U4.48(GND) U4.55(GND) U4.56(GND) U4.57(GND) U4.58(GND) U4.59(GND) U4.60(GND) U4.61(GND) U4.62(GND) U4.63(GND) U4.64(GND) U4.65(GND) U4.66(GND) U4.67(GND) U4.68(GND) U4.69(GND) U4.70(GND) U4.71(GND) U4.72(GND) U4.73(GND) U4.74(GND) U4.75(GND) U4.76(GND) U4.77(GND) U4.78(GND) U4.79(GND) U4.80(GND) U4.81(GND) U4.82(GND) U4.83(GND) U4.84(GND) U4.85(GND) U4.86(GND) U4.87(GND) U4.88(GND) U4.89(GND) U4.90(GND) U4.91(GND) U4.92(GND) U4.93(GND) U4.94(GND) U4.95(GND) U4.96(GND) U4.97(GND) U4.98(GND) U4.99(GND) U4.100(GND) U4.101(GND) U4.102(GND) U5.10(GND) U5.12(GND) U5.13(GND) U5.24(GND) U8.1(GND) U8.3(GND) U8.5(GND) U8.9(DTR_I) U8.10(RTS_I) U8.14(GND) U8.20(GND) U8.21(GND) U8.22(GND) U8.30(GND) U8.32(GND) U8.43(GND) U8.50(GND) U8.54(GND) U8.55(GND) U8.57(GND) U8.58(GND) U8.60(GND) U8.61(GND) U8.63(GND) U8.64(GND) U8.65(GND) U8.66(GND) U8.67(GND) U8.68(GND) U8.69(GND) U8.70(GND) U8.71(GND) U8.72(GND) U8.73(GND) U8.74(GND) U8.75(GND) U8.76(GND) U8.77(GND) U8.78(GND) U8.79(GND) U8.80(GND) U8.81(GND) U8.82(GND) U8.83(GND) U8.84(GND) U8.85(GND) U8.86(GND) U8.87(GND) U8.88(GND) U8.89(GND) U8.90(GND) U8.91(GND) U8.92(GND) U8.93(GND) U8.94(GND) U8.95(GND) U8.96(GND) U11.2(P$V-) U13.2(P$V-) U14.1(GND) U14.3(GND) U14.4(GND) U14.6(GND) U14.7(GND) U15.11(TEST) U15.EP(GND) U16.7(DIR3) U16.9(!OE) U16.10(GND) U18.3(P$V-) ; also sheet 1
GNSS_!RESET!: C58.1 R64.1 U4.49(!RESET!) U5.8(!RESET!) U18.2(A) ; also sheet 1
LARA_18_NI: U8.16(GPIO1) U16.3(A1)
LARA_18_RXDO: U8.13(RXD_O) U16.4(A2)
LARA_18_TXDI: U8.12(TXD_I) U16.5(A3)
LARA_!RESET!: Q6.3(D) U8.18(RESET_N)
LARA_PWR_ON: Q5.3(D) U8.15(PWR_ON)
N$3: R7.2 U4.40(USB_D+)
N$6: R8.2 U4.39(USB_D-)
N$8: J6.SHLD1(SHLD) J6.SHLD2(SHLD) J6.SHLD3(SHLD) J6.SHLD4(SHLD) SHLD2.2
N$9: R27.1 U4.51(EXTINT)
N$11: R46.1 U4.27(TX2)
N$16: R68.1 U18.4(Y)
N$17: R66.2 U5.6(USB_D+)
N$18: R67.2 U5.5(USB_D-)
N$32: R47.1 U4.26(RX2)
N$33: J6.B5(CC2) R33.2
N$34: J6.A5(CC1) R34.2
N$35: R56.1 U11.1(OUT)
N$36: R6.1 U4.53(TIMEPULSE)
N$38: Q2.5(B) R56.2
N$40: Q2.2(B) R63.2
N$41: R63.1 U13.1(OUT)
N$42: Q6.1(G) R68.2
N$43: I2C1.3 R71.2
N$44: I2C1.1 R72.2
N$46: R9.2 U8.28(USB_D-)
N$47: R10.2 U8.29(USB_D+)
N$48: C63.2 R13.2 U15.33(XTALIN) Y2.3
N$49: C64.2 R13.1 U15.32(XTALOUT) Y2.1
N$50: R12.1 U15.35(RBIAS)
N$51: R14.2 U15.28(SUSP_IND)
N$52: R17.2 U15.25(HS_IND/CFG1)
N$53: C65.1 U15.34(PLLFILT)
N$54: C66.1 U15.14(CRFILT)
N$55: R22.2 U15.30(USBDM_UP)
N$56: R23.2 U15.31(USBDP_UP)
N$61: C82.2 D12.1 LARA_RF1.SIG(SIGNAL)
N$62: C82.1 L2.1 U8.56(ANT)
N$63: C83.2 D13.1 LARA_RF2.SIG(SIGNAL)
N$64: C83.1 L3.1 U8.62(ANT2)
N$65: Q5.1(G) R70.2
NEO_RXI: NEO_RX.1 U5.21(RXD1/PICO)
NEO_TXO: NEO_TX.1 U5.20(TXD1/POCI)
RF: C13.1 D1.1 FB1.2 GNSS_RF.SIG(SIGNAL)
SIM_CLK: C71.1 D11.1 J2.C3(CLK) U8.38(SIM_CLK)
SIM_IO: C74.2 D11.6 J2.C7(I/O) U8.39(SIM_IO)
SIM_RST: C72.2 D11.4 J2.C2(RST) U8.40(SIM_RST)
USB251SCL: R52.2 U15.24(SCL/CFG0) USB251SCL.2
USB251SDA: R44.2 U15.22(SDA) USB251SDA.2
USB_!RESET: C67.1 R18.1 U15.26(!RESET)
V_ANT: C11.1 FB1.1 R55.2 R59.2 R60.2 R61.2 U11.3(+IN) U13.4(-IN) VANT.1
V_USB_2: D8.5(VCC) J6.VBUS1(VBUS) J6.VBUS2(VBUS) R21.2 U8.17(VUSB_DET) VUSB2.1 ; also sheet 1
VBUS_DET: C68.1 R20.2 R21.1 U15.27(VBUS_DET)
VCCIO: C69.1 C70.1 U8.4(V_INT) U16.1(DIR1) U16.2(DIR2) U16.6(A4) U16.8(DIR4) U16.16(VCCA) VCCIO.1
VSIM: C73.1 C75.2 D11.3 J2.C1(VCC) U8.41(VSIM)
ZED_EXTINT: R27.2 R28.1 ZED_EXTINT.1 ; also sheet 1
ZED_RX2: R47.2 RX2.1 ; also sheet 1
ZED_TP: R6.2 TP.1 ; also sheet 1
ZED_TX2: R46.2 TX2.1 ; also sheet 1
Unconnected: D8.4(IO3) D8.6(IO4) J2.C6(VPP) U4.5(ANT_OFF) U4.7(V_RF) U4.19(GEO_STAT) U4.20(RTK_STAT) U4.46(TX_READY) U4.47(D_SEL) U5.2(D_SEL) U5.3(TXD2) U5.4(RXD2) U5.9(VCC_RF) U5.14(ANT_OFF) U5.15(ANT_DETECT) U5.16(!ANT_SHORT!) U5.17(EXT_INT) U8.6(DSR_O) U8.7(RI_O) U8.8(DCD_O) U8.11(CTS_O) U8.19(GPIO6) U8.23(GPIO2) U8.24(GPIO3) U8.25(GPIO4) U8.26(SDA) U8.27(SCL) U8.34(I2S_WA) U8.35(I2S_TXD) U8.36(I2S_CLK) U8.37(I2S_RXD) U8.42(GPIO5) U8.59(ANT_DET) U15.8(USBDM_DN4) U15.9(USBDP_DN4) U15.12(PRTPWR1) U15.13(!OCS1) U15.16(PRTPWR2) U15.17(!OCS2) U15.18(PRTPWR3) U15.19(!OCS3) U15.20(PRTPWR4) U15.21(!OCS4) U16.11(B4)

### Notes on the sheet
- u-blox ZED-F9P | u-blox NEO-D9S | u-blox LARA-R6001
- VCC Range: 3.0 - 3.6V
- VCC Range: 3.0 - 3.6V
- 50Ω
- 50Ω
- 50Ω
- 90Ω | 50Ω
- 90Ω
- 7-bit unshifted I2C address: 0x43
- 7-bit unshifted I2C address: 0x42
- Close jumpers to
  enable pull-ups
- 90Ω
- USB Hub USB-C | USB Hub
- Open Collector
  Outputs
- Open jumper to isolate shield
- SIM
- 7-bit unshifted I²C address: 0x2C
- USB2513, or USB2514 can be used
- Antenna Power
- Antenna Splitter
- 50Ω | 50Ω
- Vcc Max: 5.5V
- 50Ω
- ANT | 50Ω | ANT_ZED
- For non-L-Band products:
  Do Not Populate U14
  Change BYPASS1 & BYPASS2 to PASTE
  (Or solder closed manually)
- Paul Clark
- Vcc Max: 5.5V
- v11

## Library data of the parts
3V3 3V3_SW 3V3_SW2 5V 9% 99% !SAFEBOOT_NEO! !SAFEBOOT_ZED! ANT_DET ANT_SHT DET DTR ETH_CS ETH_INT GND NEO_RX NEO_TX PICO POCI PWREN RTS RX RX2 RXD SCK SCL SCL2 SD_CS SDA SDA2 TP TP_BOOT TP_LED TX TX2 TXD VANT VCCA VCCIO VIN VPOE VUSB VUSB2 ZED_EXTINT ZED_RXI ZED_TXO = SparkFun-Connectors:TEST-POINT: SparkFun Test Points Bare copper test points for troubleshooting or In-Circuit-Testing. These are used by our Production team for verifying production board runs using pogo-pins on test beds. SparkFun Products: SparkFun LSM9DS1 Breakout <https://www.sparkfun.com/products/13284> SparkFun PSOC <https://www.sparkfun.com/products/13714> SparkFun Load Cell Amplifier <https://www.sparkfun.com/products/13879>
ACT BOOT_SW LED LINK LOAD RESET_SW SHLD1 SHLD2 = SparkFun-Jumpers:JUMPER-SMT_2_NC_TRACE: Normally closed trace jumper This jumper has a trace between two pads so it's normally closed (NC). Use a razor knife to open the connection. For best results follow the IPC guidelines for cutting traces: Cutout at least 0.063 mm (0.005 in). Remove all loose material to clean up the cut area. Seal the cut with an approved epoxy. Reapply solder to reclose the connection.
BOOT RESET = SparkFun-Switches:MOMENTARY-SWITCH-SPST: Momentary Switch (Pushbutton) - SPST Normally-open (NO) SPST momentary switches (buttons, pushbuttons). Variants PTH-12MM - 12mm square, through-hole Momentary Pushbutton Switch - 12mm Square <https://www.sparkfun.com/products/9190> (COM-09190) PTH-6.0MM, PTH-6.0MM-KIT - 6.0mm square, through-hole Mini Pushbutton Switch <https://www.sparkfun.com/products/97> (COM-00097) KIT package intended for soldering kit's - only one side of pads' copper is exposed. PTH-RIGHT-ANGLE-KIT - Right-angle, through-hole Right Angle Tactile Button <https://www.sparkfun.com/products/10791> - Used on SparkFun BigTime Watch Kit <https://www.sparkfun.com/products/11734> SMD-12MM - 12mm square, surface-mount Tactile Button - SMD (12mm) <https://www.sparkfun.com/products/12993> (COM-12993) Used on SparkFun PicoBoard <https://www.sparkfun.com/products/11888> SMD-4.5MM - 4.5mm Square Trackball Switch Used on SparkFun Blackberry Trackballer Breakout <https://www.sparkfun.com/products/13169> SMD-4.6MMX2.8MM - 4.60mm x 2.80mm, surface mount Used on SparkFun Pro Micro - RP2040 <https://www.sparkfun.com/products/17717> SMD-5.2MM, SMD-5.2-REDUNDANT - 5.2mm square, surface-mount Mini Pushbutton Switch - SMD <https://www.sparkfun.com/products/8720> (COM-08720) Used on Arduino Pro Mini <https://www.sparkfun.com/products/11114> REDUNDANT package connects both switch circuits together SMD-6.0X3.5MM - 6.0 x 3.5mm, surface mount Momentary Reset Switch SMD <https://www.sparkfun.com/products/8229> (COM-08229) SMD-6.2MM-TALL - 6.2mm square, surface mount Tactile Button - SMD (6mm) <https://www.sparkfun.com/products/12992> Used on SparkFun Digital Sandbox <https://www.sparkfun.com/products/12651> SMD-RIGHT-ANGLE - Right-angle, surface mount Used on SparkFun Block for Intel® Edison - Arduino <https://www.sparkfun.com/products/13036>; PROD_ID: SWCH-13896
BYPASS1 BYPASS2 = SparkFun-Jumpers:JUMPER-SMT_2_SOIC-PAD_NO-PASTE
C1 C3 C5 C6 C8-C10 C14 C18 C22 C23 C25 C26 C29 C56 C59 C60 = SparkFun-Capacitors:2.2UF: 2.2µF ceramic capacitors A capacitor is a passive two-terminal electrical component used to store electrical energy temporarily in an electric field.; PROD_ID: CAP-07888
C2 C7 C15 C17 C19 C21 C30 C31 C33-C38 C52-C54 C58 C61 C62 C65-C70 C75 C78 = SparkFun-Capacitors:0.1UF: 0.1µF ceramic capacitors A capacitor is a passive two-terminal electrical component used to store electrical energy temporarily in an electric field.; PROD_ID: CAP-08604
C4 C40 C43 = SparkFun-Capacitors:10NF: 0.01uF/10nF/10,000pF ceramic capacitors A capacitor is a passive two-terminal electrical component used to store electrical energy temporarily in an electric field. CAP-09321; PROD_ID: CAP-00867
C11 C13 C71-C74 = SparkFun-Capacitors:47PF: 47pF ceramic capacitors A capacitor is a passive two-terminal electrical component used to store electrical energy temporarily in an electric field.; PROD_ID: CAP-08913
C12 C24 = SparkFun-Capacitors:1.0UF: 1µF ceramic capacitors A capacitor is a passive two-terminal electrical component used to store electrical energy temporarily in an electric field.; PROD_ID: CAP-00868
C16 C48 C57 C76 = SparkFun-Capacitors:100UF-POLAR: 100µF polarized capacitors A capacitor is a passive two-terminal electrical component used to store electrical energy temporarily in an electric field.; PROD_ID: CAP-12547
C20 C32 C39 C55 = SparkFun-Capacitors:10UF: 10.0µF ceramic capacitors A capacitor is a passive two-terminal electrical component used to store electrical energy temporarily in an electric field.; PROD_ID: CAP-11015
C27 C28 = SparkFun-Capacitors:10PF: 10pF ceramic capacitors A capacitor is a passive two-terminal electrical component used to store electrical energy temporarily in an electric field.; PROD_ID: CAP-11812
C41 = SparkFun-Capacitors:4.7UF: 4.7µF ceramic capacitors A capacitor is a passive two-terminal electrical component used to store electrical energy temporarily in an electric field.; PROD_ID: CAP-08280
C42 = SparkFun-Capacitors:1.0NF/1000PF: 1nF/1,000pF ceramic capacitors A capacitor is a passive two-terminal electrical component used to store electrical energy temporarily in an electric field.; PROD_ID: CAP-16238
C44 C45 = SparkFun-Capacitors:6.8NF/6800PF: 5.6nF/5600pF ceramic capacitors A capacitor is a passive two-terminal electrical component used to store electrical energy temporarily in an electric field.; PROD_ID: CAP-16239
C46 = SparkFun-Capacitors:22NF/22,000PF: 0.022uF/22nF/22,000pF ceramic capacitors A capacitor is a passive two-terminal electrical component used to store electrical energy temporarily in an electric field.; PROD_ID: CAP-07885
C47 C49-C51 C77 C84 C85 = SparkFun-Capacitors:10UF: 10.0µF ceramic capacitors A capacitor is a passive two-terminal electrical component used to store electrical energy temporarily in an electric field.; PROD_ID: CAP-14259
C63 C64 = SparkFun-Capacitors:18PF: 18pF ceramic capacitors A capacitor is a passive two-terminal electrical component used to store electrical energy temporarily in an electric field.; PROD_ID: CAP-08267
C79 = SparkFun-Capacitors:15PF: 15pF ceramic capacitors A capacitor is a passive two-terminal electrical component used to store electrical energy temporarily in an electric field.; PROD_ID: CAP-07881
C80 = SparkFun-Capacitors:8.2PF: 8.2pF ceramic capacitors A capacitor is a passive two-terminal electrical component used to store electrical energy temporarily in an electric field.; PROD_ID: CAP-16662
C81 = SparkFun-Capacitors:68PF: 68pF ceramic capacitors A capacitor is a passive two-terminal electrical component used to store electrical energy temporarily in an electric field.; PROD_ID: CAP-14092
C82 C83 = SparkFun-Capacitors:33PF: 33pF ceramic capacitors A capacitor is a passive two-terminal electrical component used to store electrical energy temporarily in an electric field.; PROD_ID: CAP-10142
C86 = SparkFun-Capacitors:47UF-POLAR: 47µF polarized capacitors A capacitor is a passive two-terminal electrical component used to store electrical energy temporarily in an electric field.; PROD_ID: CAP-10547
D1 D3 D12 D13 D15-D20 = SparkFun-DiscreteSemi:PESD0402: ESD protection diode PESD is used to protect a signal line from ESD.; DIGIKEY_PART: PESD0402-140CT-ND; MOUSE_PART: 650-PESD0402-140; PROD_ID: DIO-15359
D2 = SparkFun-LED:LED-RIGHT-ANGLE-PTH; PROD_ID: DIO-13847
D4-D6 D9 = SparkFun-DiscreteSemi:DIODE-SCHOTTKY: Schottky diode A Schottky diode is a semiconductor diode which has a low forward voltage drop and a very fast switching action.; PROD_ID: DIO-14072
D7 D8 D10 = SparkFun-DiscreteSemi:TVS_DIODE_ARRAY; PROD_ID: IC-13538
D11 = SparkFun-DiscreteSemi:TVS_DIODE_ARRAY_4; PROD_ID: DIO-14095
D14 = SparkFun-DiscreteSemi:DIODE-SCHOTTKY: Schottky diode A Schottky diode is a semiconductor diode which has a low forward voltage drop and a very fast switching action.; PROD_ID: DIO-09886; VALUE: 3A/40V/500mV
ESP32_RF = SparkFun-RF:ANTENNA-SMA-GROUNDED: SMA Antenna Connector w/ Ground Edge-mount and SMD SMA connectors for RF Antennas. **4-LAYER BOARD WARNING!!** When designing a 4-layer board using any of the SMD variants, you will need to manually add a cutout polygon on any internal power layers to make sure that you don't end up with exposed copper around the edge of the routed hole for these connectors. Exposed power copper could then short to the connector body - and that would be bad. Why hasn't anyone added the cutout polygons directly to the connector footprint? Well, your internal layers (usually 2 and 15) may be covered with GND polygons and you might well want the copper to go all the way to the edge, especially under the connector SIGNAL pin. So adding cutouts to the footprint might make matters worse, not better...; PROD_ID: CONN-00827
F1 = SparkFun-Fuses:PPTC: Resettable Fuse PPTC Resettable Fuse. Really a sort of resistor with a polymeric positive temperature coefficient whose resistance increases dramatically with an increase in temperature. When heated by the power passing through the resistance rises causing the current to be limited, protecting the circuit. This is achieved by the transition of the polymer from a crystalline to an amorphous state where the conductive carbon separates breaking the conductive pathways found in the cool crystalline structure. When a PPTC cools back down it resumes conducting letting the circuit turn back on. SparkFun Products: SparkFun RedBoard - Programmed with Arduino <https://www.sparkfun.com/products/12757> Pro Micro - 5V/16MHz <https://www.sparkfun.com/products/12640> Arduino Pro 328 - 5V/16MHz <https://www.sparkfun.com/products/10915> MP3 Trigger <https://www.sparkfun.com/products/13720>; PROD_ID: RES-14313
FB1 = SparkFun-Coils:FERRITE_BEAD: Ferrite Bead (blocks, cores, rings, chokes, etc.) Inductor with layers of ferrite used to suppress high frequencies. Often used to isolate high frequency noise. SparkFun Products: IOIO-OTG - V2.2 <https://www.sparkfun.com/products/13613> SparkFun SAMD21 Mini Breakout <https://www.sparkfun.com/products/13664> SparkFun 6 Degrees of Freedom Breakout - LSM6DS3 <https://www.sparkfun.com/products/13339> SparkFun SAMD21 Dev Breakout <https://www.sparkfun.com/products/13672> Lilypad MP3 <https://www.sparkfun.com/products/11013>; PROD_ID: NDUC-14988
FB2 = SparkFun-Coils:FERRITE_BEAD: Ferrite Bead (blocks, cores, rings, chokes, etc.) Inductor with layers of ferrite used to suppress high frequencies. Often used to isolate high frequency noise. SparkFun Products: IOIO-OTG - V2.2 <https://www.sparkfun.com/products/13613> SparkFun SAMD21 Mini Breakout <https://www.sparkfun.com/products/13664> SparkFun 6 Degrees of Freedom Breakout - LSM6DS3 <https://www.sparkfun.com/products/13339> SparkFun SAMD21 Dev Breakout <https://www.sparkfun.com/products/13672> Lilypad MP3 <https://www.sparkfun.com/products/11013>; PROD_ID: NDUC-12579
FD1-FD4 = SparkFun-Aesthetics:FIDUCIAL: Fiducial Alignment Points Point-of-reference for pick-and-place machines and other optical instruments.
FRAME1 FRAME2 = SparkFun-Aesthetics:FRAME-LEDGER: Schematic Frame - Ledger Standard 11x14 US Ledger frame
GNSS_RESET = SparkFun-Jumpers:JUMPER-COMBO_2_NO
GNSS_RF LARA_RF1 LARA_RF2 = SparkFun-RF:ANTENNA-SMA-GROUNDED: SMA Antenna Connector w/ Ground Edge-mount and SMD SMA connectors for RF Antennas. **4-LAYER BOARD WARNING!!** When designing a 4-layer board using any of the SMD variants, you will need to manually add a cutout polygon on any internal power layers to make sure that you don't end up with exposed copper around the edge of the routed hole for these connectors. Exposed power copper could then short to the connector body - and that would be bad. Why hasn't anyone added the cutout polygons directly to the connector footprint? Well, your internal layers (usually 2 and 15) may be covered with GND polygons and you might well want the copper to go all the way to the edge, especially under the connector SIGNAL pin. So adding cutouts to the footprint might make matters worse, not better...; PROD_ID: CONN-08289
H1-H6 = SparkFun-Hardware:STAND-OFF: Stand Off Drill holes for mechanically mounting via screws, standoffs, etc. Note: Use the keepout ring to avoid running the screw head into surrounding components. Variant Overviews STAND-OFF - Mechanical footprint for a #4 phillips button head screw. STAND-OFF-TIGHT - Mechanical footprint for a #4 phillips button head screw, Example SparkFun Products Screw - Phillips Head (1/4", 4-40, 10 pack) <https://www.sparkfun.com/products/10453> (PRT-10453) Screw - Phillips Head (1/2", 4-40, 10 pack) <https://www.sparkfun.com/products/10452> (PRT-10452) Screw - Phillips Head (3/4", 4-40, 10 pack) <https://www.sparkfun.com/products/10451> (PRT-10451) Screw - Phillips Head (1", 4-40, 10 pack) <https://www.sparkfun.com/products/10450> (PRT-10450)
I2C I2C1 = SparkFun-Jumpers:JUMPER-SMT_3_NO: Normally open jumper This jumper has three pads in close proximity to each other. Apply solder to close the connection(s).
J1 J6 = SparkFun-Connectors:USB_C: USB Type C 16Pin Connector Super Speed pins not available on the 16-pin purely SMD connector so this part is best for USB 2.0 implementations. D1 and D2 are tied together enabling D+/- no matter which way the cable is plugged into the connector. The two channel configuration pins (CC1/2) are exposed. These are normally connected to ground via 5.1k resistors but can be reconfigured for high current/high power applications. **4-LAYER BOARD WARNING!!** If designing 4-layer board, make sure to select the variant _4-LAYER-ISOLATED. The linked footprint (USB-C-16-4LAYER-ISOLATED) includes some very necessary cutout polygons in the inner layers (2 and 15). This prevents the PTH mounting shield legs on the USB connector from electrically connecting any other polygons on the inner layers (usually VCC and GND).; PROD_ID: CONN-14122
J2 = SparkFun-Connectors:SIMHOLDER: SIM Cellular Card Socket SMT 6 pin standard connection. SparkFun Products: SIM Socket <https://www.sparkfun.com/products/548> SparkFun Cellular Shield - MG2639 <https://www.sparkfun.com/products/13120> SparkFun SIM Card Socket Breakout <https://www.sparkfun.com/products/573>; PROD_ID: CONN-16272
J3 = SparkFun-Connectors:MICRO-SD: microSD Socket for Transflash Various sockets for µSD. tDoc lines correctly indicate media card edge positions when inserting (unlocked, locked, depressed). NOTE: CD1 and CD2 are connected internally, and the default detect state of the socket is detect pin to ground. SparkFun Products: WAV Trigger <https://www.sparkfun.com/products/13660> CAN-Bus Shield <https://www.sparkfun.com/products/13262> SparkFun Level Shifing microSD Breakout <https://www.sparkfun.com/products/13743>; PROD_ID: CONN-16110
J4 = SparkFun-Connectors:QWIIC_CONNECTOR: SparkFun I2C Standard Qwiic Connector An SMD 1mm pitch JST connector makes it easy and quick (get it? Qwiic?) to connect I2C devices to each other. The Qwiic system <http://www.sparkfun.com/qwiic> enables fast and solderless connection between popular platforms and various sensors and actuators. We carry 200mm <https://www.sparkfun.com/products/14204>, 100mm <https://www.sparkfun.com/products/14205>, 50mm <https://www.sparkfun.com/products/14206>, and breadboard friendly <https://www.sparkfun.com/products/14207> Qwiic cables. We also offer 10 pcs strips <https://www.sparkfun.com/products/14323> the SMD connectors.; PROD_ID: CONN-14483
J8 = SparkFun-Connectors:U.FL2PIN: SMD Antenna Connector - U.FL 2mm height, 3.0mm x 3.0mm receptacle size. SparkFun Products: SparkFun WiFi Shield - ESP8266 <https://www.sparkfun.com/products/13287> SparkFun ESP8266 Thing <https://www.sparkfun.com/products/13231> SparkFun MiniGen - Pro Mini Signal Generator Shield <https://www.sparkfun.com/products/11420>; PROD_ID: CONN-09193
J9 = SparkFun-Connectors:MAGJACK-POE: MAGJACK: RJ-45 with POE and LEDs This is a single port, RJ45 ethernet jacks with built in transformer (magnetics), PoE rectifier diodes, status LEDs, and shielding.; PROD_ID: CONN-16253
J13 = SparkFun-Connectors:CONN_10: Multi connection point. Often used as Generic Header-pin footprint for 0.1 inch spaced/style header connections On any of the 0.1 inch spaced packages, you can populate with these: Break Away Headers - Straight <https://www.sparkfun.com/products/116> (PRT-00116) Break Away Male Headers - Right Angle <https://www.sparkfun.com/products/553> (PRT-00553) Female Headers <https://www.sparkfun.com/products/115> (PRT-00115) Break Away Headers - Machine Pin <https://www.sparkfun.com/products/117> (PRT-00117) Break Away Female Headers - Swiss Machine Pin <https://www.sparkfun.com/products/743> (PRT-00743) Arduino Stackable Header - 10 Pin <https://www.sparkfun.com/products/11376> (PRT-11376) For SCREWTERMINALS and SPRING TERMINALS visit here: Screw Terimnals on SparkFun.com <https://www.sparkfun.com/search/results?term=Screw+Terminals> (5mm/3.5mm/2.54mm spacing) This device is also useful as a general connection point to wire up your design to another part of your project. Our various solder wires solder well into these plated through hole pads. Hook-Up Wire - Assortment (Stranded, 22 AWG) <https://www.sparkfun.com/products/11375> (PRT-11375) Hook-Up Wire - Assortment (Solid Core, 22 AWG) <https://www.sparkfun.com/products/11367> (PRT-11367) View the entire wire category on our website here <https://www.sparkfun.com/categories/141> Special notes: Molex polarized connector foot print use with SKU : PRT-08231 with associated crimp pins and housings. 1MM SMD Version SKU: PRT-10208 NOTES ON THE VARIANTS LOCK and LOCK_LONGPADS... This footprint was designed to help hold the alignment of a through-hole component (i.e. 6-pin header) while soldering it into place. You may notice that each hole has been shifted either up or down by 0.005 of an inch from it's more standard position (which is a perfectly straight line). This slight alteration caused the pins (the squares in the middle) to touch the edges of the holes. Because they are alternating, it causes a "brace" to hold the component in place. 0.005 has proven to be the perfect amount of "off-center" position when using our standard breakaway headers. Although looks a little odd when you look at the bare footprint, once you have a header in there, the alteration is very hard to notice. Also,if you push a header all the way into place, it is covered up entirely on the bottom side.; PROD_ID: CONN-17279; STOREFRONT: PRT-21328
L1 L4 = SparkFun-Coils:INDUCTOR: Inductors Resist changes in electrical current. Basically a coil of wire. SparkFun Products: SparkFun Load Cell Amplifier - HX711 <https://www.sparkfun.com/products/13879> IOIO-OTG - V2.2 <https://www.sparkfun.com/products/13613>; PROD_ID: NDUC-14234
L2 L3 = SparkFun-Coils:DNP
LOGO1 = SparkFun-Aesthetics:SPECIAL_INSTRUCTIONS: Special Ordering/Production Instructions Alert Symbol for special PCB ordering instructions or unique production process warnings. Ordering Instructions Production Instructions Types of information that should be added to box: Copper weight Soldermask color Silk color PCB thickness Number of layers PCB Standard: 1.6mm FR4 1 oz copper immersion silver plating red soldermask white silkscreen Types of information that should be added to box: Special wash requirements Depaneling instructions Humidification Glue curing Default text settings: 0.07 inch 9% ratio 50% line distance
LOGO4 = SparkFun-Aesthetics:OSHW-LOGO: Open-Source Hardware (OSHW) Logo This logo indicates the piece of hardware it is found on incorporates a OSHW license and/or adheres to the definition of open source hardware found here: http://freedomdefined.org/OSHW
LOGO5 = SparkFun-Aesthetics:SFE_LOGO_NAME: SparkFun Font Logo This is the SparkFun name logo. The logo on the schematic will always be the same size; the package variant is the height of the flame part of the logo (or the height the flame would be, if it were drawn). Default layer for the logo on the board is tSilk.
LOGO6 = SparkFun-Aesthetics:SFE_LOGO_FLAME: SparkFun Flame Logo This is the SparkFun flame logo. The logo on the schematic will always be the same size; the package variant is the height of the flame. Default layer for the logo on the board is tSilk.
MEAS PW+ PW- VIN+ VIN- = SparkFun-Jumpers:JUMPER-COMBO_2_NC_TRACE
PM0 PM1 PM2 USB251SCL USB251SDA = SparkFun-Jumpers:JUMPER-SMT_2_NO: Normally open jumper This jumper has two pads in close proximity to each other. Apply solder to close the connection. Round pads are easier to solder for beginners, but are a lot larger. SparkFun Product that uses the round pads: SparkFun EL Sequencer <https://www.sparkfun.com/products/12781>
Q1 Q2 = SparkFun-DiscreteSemi:TRANS_NPN_DUAL: Dual NPN Transistors in Single Package The MBT3904W1 puts two general purpose 3904 NPN transistors in a single package. Datasheet <http://www.onsemi.com/pub_link/Collateral/MBT3904DW1T1-D.PDF> SparkFun Products: SparkFun ESP32 Thing <https://www.sparkfun.com/products/13907>; PROD_ID: TRANS-13337
Q5 Q6 = SparkFun-DiscreteSemi:MOSFET-NCH: N-channel MOSFETs Voltage controlled devices that allow control of high current outputs. SparkFun Products: SparkFun OpenScale <https://www.sparkfun.com/products/13261> SparkFun Digital Sandbox <https://www.sparkfun.com/products/12651> SparkFun Monster Moto Shield <https://www.sparkfun.com/products/10182> SparkFun MOSFET Power Controller <https://www.sparkfun.com/products/11214>; PROD_ID: TRANS-11151
R1 R2 R33 R34 = SparkFun-Resistors:5.1KOHM; PROD_ID: RES-12083
R3-R5 R11 R15 R28 R30-R32 R49 R54 R57 R58 R64 VID1 = SparkFun-Resistors:10KOHM: 10kΩ resistor A resistor is a passive two-terminal electrical component that implements electrical resistance as a circuit element. Resistors act to reduce current flow, and, at the same time, act to lower voltage levels within circuits. - Wikipedia; PROD_ID: RES-00824
R6 R27 R36-R39 R46 R47 = SparkFun-Resistors:33OHM: 33Ω resistor A resistor is a passive two-terminal electrical component that implements electrical resistance as a circuit element. Resistors act to reduce current flow, and, at the same time, act to lower voltage levels within circuits. - Wikipedia; PROD_ID: RES-08270
R7-R10 R22 R23 R66 R67 = SparkFun-Resistors:27OHM: 27Ω resistor A resistor is a passive two-terminal electrical component that implements electrical resistance as a circuit element. Resistors act to reduce current flow, and, at the same time, act to lower voltage levels within circuits. - Wikipedia; PROD_ID: RES-09334
R12 = SparkFun-Resistors:12KOHM: 12kΩ resistor A resistor is a passive two-terminal electrical component that implements electrical resistance as a circuit element. Resistors act to reduce current flow, and, at the same time, act to lower voltage levels within circuits. - Wikipedia; PROD_ID: RES-10327
R13 R24 = SparkFun-Resistors:1MOHM: 1MΩ resistor A resistor is a passive two-terminal electrical component that implements electrical resistance as a circuit element. Resistors act to reduce current flow, and, at the same time, act to lower voltage levels within circuits. - Wikipedia; PROD_ID: RES-07868
R14 R17 R18 R20 R21 R44 R48 R50-R52 R65 R69 = SparkFun-Resistors:100KOHM: 100kΩ resistor A resistor is a passive two-terminal electrical component that implements electrical resistance as a circuit element. Resistors act to reduce current flow, and, at the same time, act to lower voltage levels within circuits. - Wikipedia; PROD_ID: RES-07828
R16 R19 R71 R72 = SparkFun-Resistors:2.2KOHM: 2.2kΩ resistor A resistor is a passive two-terminal electrical component that implements electrical resistance as a circuit element. Resistors act to reduce current flow, and, at the same time, act to lower voltage levels within circuits. - Wikipedia; PROD_ID: RES-08272
R25 R26 R53 R56 R63 R68 R70 VID2 = SparkFun-Resistors:1KOHM: 1kΩ resistor A resistor is a passive two-terminal electrical component that implements electrical resistance as a circuit element. Resistors act to reduce current flow, and, at the same time, act to lower voltage levels within circuits. - Wikipedia; PROD_ID: RES-07856
R29 = SparkFun-Resistors:12.4KOHM: 12.4kΩ resistor A resistor is a passive two-terminal electrical component that implements electrical resistance as a circuit element. Resistors act to reduce current flow, and, at the same time, act to lower voltage levels within circuits. - Wikipedia; PROD_ID: RES-16236
R35 R40-R42 = SparkFun-Resistors:49.9OHM: 49.9Ω resistor A resistor is a passive two-terminal electrical component that implements electrical resistance as a circuit element. Resistors act to reduce current flow, and, at the same time, act to lower voltage levels within circuits. - Wikipedia; PROD_ID: RES-16237
R43 = SparkFun-Resistors:10OHM: 10Ω resistor A resistor is a passive two-terminal electrical component that implements electrical resistance as a circuit element. Resistors act to reduce current flow, and, at the same time, act to lower voltage levels within circuits. - Wikipedia; PROD_ID: RES-12581
R45 R55 R59-R61 = SparkFun-Resistors:49.9OHM: 49.9Ω resistor A resistor is a passive two-terminal electrical component that implements electrical resistance as a circuit element. Resistors act to reduce current flow, and, at the same time, act to lower voltage levels within circuits. - Wikipedia; PROD_ID: RES-16252
R62 = SparkFun-Resistors:470OHM: 470Ω resistor A resistor is a passive two-terminal electrical component that implements electrical resistance as a circuit element. Resistors act to reduce current flow, and, at the same time, act to lower voltage levels within circuits. - Wikipedia; PROD_ID: RES-07869
SPWR TPWR = SparkFun-Jumpers:JUMPER-SMT_3_1-NC_TRACE: Normally closed trace jumper (1 of 2 connections) This jumper has a trace between two pads so it's normally closed (NC). The other connection is normally open (NO). Use a razor knife to open the connection. For best results follow the IPC guidelines for cutting traces: Cutout at least 0.063 mm (0.005 in). Remove all loose material to clean up the cut area. Seal the cut with an approved epoxy. Reapply solder to reclose the connection, or to close the NO connection.
U1 = SparkFun-RF:ESP32-WROVER-E/IE: ESP32-WROVER-E/IE ESP32-WROVER-E uses the onboard antenna. ESP32-WROVER-IE has a u.FL antenna connector, but is otherwise the same as the -E. N16R8 has 16M Flash, 8M PSRAM; PROD_ID: IC-19265
U2 = SparkFun-IC-Comms:CH340C; PROD_ID: IC-14038
U3 U6 = SparkFun-IC-Power:XC6222; IOUT: 700mA; PROD_ID: VREG-16775; VOUT: 3.3V
U4 = SparkFun-GPS:U-BLOX_ZED-F9P; PROD_ID: IC-14209
U5 = SparkFun-GPS:U-BLOX_NEO-D9S: u-blox NEO-D9S The NEO-D9S can receive the data stream of a GNSS correction service, broadcast via satellite L band and compliant to the specification the product is designed for. Integrated with a high precision GNSS receiver, such as from the u-blox F9 platform, it enables the positioning system to reach down to centimeter-level accuracy.; PROD_ID: IC-16579
U7 = SparkFun-IC-Comms:W5500; PROD_ID: IC-16240
U8 = SparkFun-RF:LARA-R6: u-blox LARA-R6 single or multi-mode LTE Cat 1 modules; PROD_ID: IC-16661
U9 = SparkFun-IC-Logic:74LVC4066D_QUAD_BILATERAL_SWITCH: Nexperia Quad Bilateral Switch The 74LVC4066 is a high-speed Si-gate CMOS device. The 74LVC4066 provides four single pole, single-throw analog switch functions. Each switch has two input/output terminals (nY and nZ) and an active HIGH enable input (nE). When nE is LOW, the analog switch is turned off. Schmitt-trigger action at the enable inputs makes the circuit tolerant of slower input rise and fall times across the entire VCC range from 1.65 V to 5.5 V. Datasheet <https://assets.nexperia.com/documents/data-sheet/74LVC4066.pdf>; PROD_ID: IC-13944
U10 = SparkFun-IC-Power:POE_PSU: A special function Power Over Ethernet module with 5V or 12V output. Comes in an SMD package.; PROD_ID: IC-16251
U11 U13 = SparkFun-IC-Amplifiers:MCP6021: MCP6021T-E/OT OP AMP Rail-to-rail input/output op-amp with 10 MHz bandwidth. SparkFun Products ZX Distance and Gesture Sensor <https://www.sparkfun.com/products/12780> (SEN-12780); PROD_ID: IC-12504
U12 = SparkFun-IC-Power:AP7361C-33FGE: AP7361C 3.3V LDO Regulator; PROD_ID: VREG-14094
U14 = SparkFun-RF:BP2G1+_POWER_SPLITTER: BP2G1+ 2 Ways MMIC DC Pass Power Splitter, 1200 - 2000 MHz, 50Ω; PROD_ID: IC-17198
U15 = SparkFun-IC-Special-Function:USB251XB: USB 2.0 Hi-Speed Hub Controller USB2514B is four-port; PROD_ID: IC-15827
U16 = SparkFun-IC-Comms:SN74AVC4T774PW: Texas Instruments,SN74AVC4T774PW,IC, Texas Instruments SN74AVC4T774PW, Dual, Bus Transceiver, 4-Bit Non-Inverting 3-State, 1.2 3.6 V, 16-Pin TSSOP Source: Datasheet <http://www.ti.com/lit/ds/symlink/sn74avc4t774.pdf>; PROD_ID: IC-15360
U17 = SparkFun-IC-Power:URB_YMD-15WR3: MORNSUN DC/DC Converter URB_YMD-15WR3 URB2405YMD-15WR3: Input 24V (9V-36V), Output 5.0V 3.0A; PROD_ID: COMP-19263
U18 = SparkFun-IC-Logic:74*1G04: Single Inverter IC NOT GATE INVERTER SNGL 1IN SOT353 Supply: 1.65V to 5.5V Datasheet <http://diodes.com/datasheets/74LVC1G04.pdf> SparkFun Products SparkFun Stepoko <https://www.sparkfun.com/products/13899> (ROB-13899) SparkFun CryptoShield <https://www.sparkfun.com/products/13183> (DEV-13183) SparkFun LogicBlocks Kit <https://www.sparkfun.com/products/11006> (KIT-11006) SparkFun ArduMoto <https://www.sparkfun.com/products/9815> (DEV-09815); PROD_ID: COMP-08268
Y1 = SparkFun-Clocks:CRYSTAL-25MHZ: 25MHz Crystal; PROD_ID: XTAL-16235
Y2 = SparkFun-Clocks:CRYSTAL-24MHZ: 24MHz Crystal Datasheet <http://www.sparkfun.com/datasheets/Components/AT-SMD-5x3.pdf> Frequency: 24MHz Frequency Tolerance: ±20ppm Load Capacitance: 12pF SparkFun Products: USB Bit Whacker <https://www.sparkfun.com/products/762>; PROD_ID: XTAL-14845

## Net classes
2 3.3V: width 0.508 mm
3 RF_IN: width 0.35 mm, clearance 0.46 mm
4 USB: width 0.203 mm, clearance 0.127 mm
7 V_ZED: width 0.2 mm, clearance 0.2 mm
8 V_RF: width 0.2 mm
11 ZED_DIG: width 0.1 mm, clearance 0.1 mm